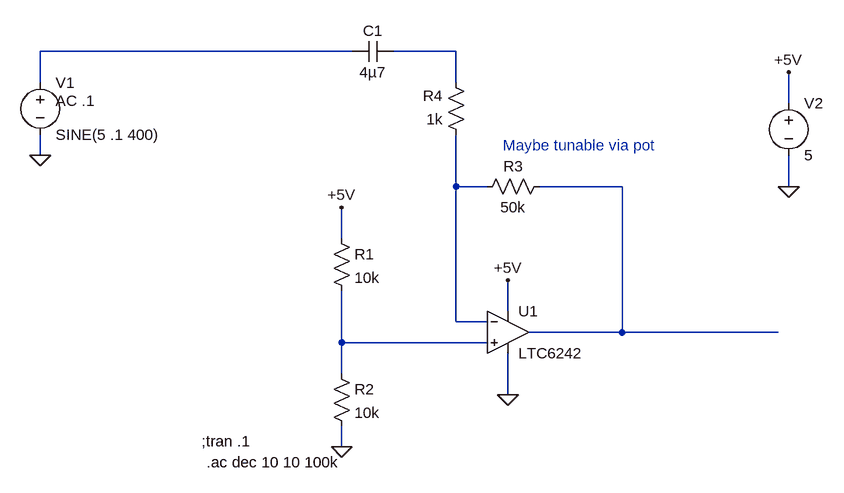
[diagram p0: schematic preamp_opamp2.asc]
preamp_opamp2.asc, the LTspice schematic file:
Version 4
SHEET 1 880 680
WIRE -80 -240 -560 -240
WIRE 80 -240 -16 -240
WIRE -560 -192 -560 -240
WIRE 80 -192 80 -240
WIRE 592 -160 592 -208
WIRE -560 -80 -560 -112
WIRE 80 -32 80 -112
WIRE 128 -32 80 -32
WIRE 336 -32 208 -32
WIRE 592 -32 592 -80
WIRE -96 48 -96 0
WIRE 160 160 160 112
WIRE 80 176 80 -32
WIRE 128 176 80 176
WIRE 336 192 336 -32
WIRE 336 192 192 192
WIRE 576 192 336 192
WIRE -96 208 -96 128
WIRE 128 208 -96 208
WIRE -96 256 -96 208
WIRE 160 288 160 224
WIRE -96 368 -96 336
FLAG -96 368 0
FLAG -560 -80 0
FLAG 160 288 0
FLAG 592 -32 0
FLAG 592 -208 +5V
FLAG 160 112 +5V
FLAG -96 0 +5V
SYMBOL res -112 32 R0
SYMATTR InstName R1
SYMATTR Value 10k
SYMBOL res -112 240 R0
SYMATTR InstName R2
SYMATTR Value 10k
SYMBOL cap -16 -256 R90
WINDOW 0 0 32 VBottom 2
WINDOW 3 32 32 VTop 2
SYMATTR InstName C1
SYMATTR Value 4µ7
SYMBOL res 224 -48 R90
WINDOW 0 0 56 VBottom 2
WINDOW 3 32 56 VTop 2
SYMATTR InstName R3
SYMATTR Value 50k
SYMBOL res 96 -96 R180
WINDOW 0 36 76 Left 2
WINDOW 3 36 40 Left 2
SYMATTR InstName R4
SYMATTR Value 1k
SYMBOL voltage -560 -208 R0
WINDOW 123 24 44 Left 2
WINDOW 39 0 0 Left 2
SYMATTR Value2 AC .1
SYMATTR InstName V1
SYMATTR Value SINE(5 .1 400)
SYMBOL voltage 592 -176 R0
WINDOW 123 0 0 Left 2
WINDOW 39 0 0 Left 2
SYMATTR InstName V2
SYMATTR Value 5
SYMBOL Opamps\\LTC6242 160 192 R0
SYMATTR InstName U1
TEXT -304 392 Left 2 !.ac dec 10 10 100k
TEXT -312 360 Left 2 !;tran .1
TEXT 152 -96 Left 2 ;Maybe tunable via pot

The netlist it stands for:
* preamp_opamp2.asc
R1 +5V N005 10k
R2 N005 0 10k
C1 N002 N001 4µ7
R3 N004 N003 50k
R4 N003 N002 1k
V1 N001 0 SINE(5 .1 400) AC .1
V2 +5V 0 5
* U1: LTC6242 (symbol Opamps\LTC6242 not available, pins judged from their places): In+=N005 In-=N003 V+=+5V V-=0 OUT=N004
.ac dec 10 10 100k
;tran .1
* Maybe tunable via pot
.backanno
.end